# EAGLE design smartbedlight2 (EAGLE 6.1)
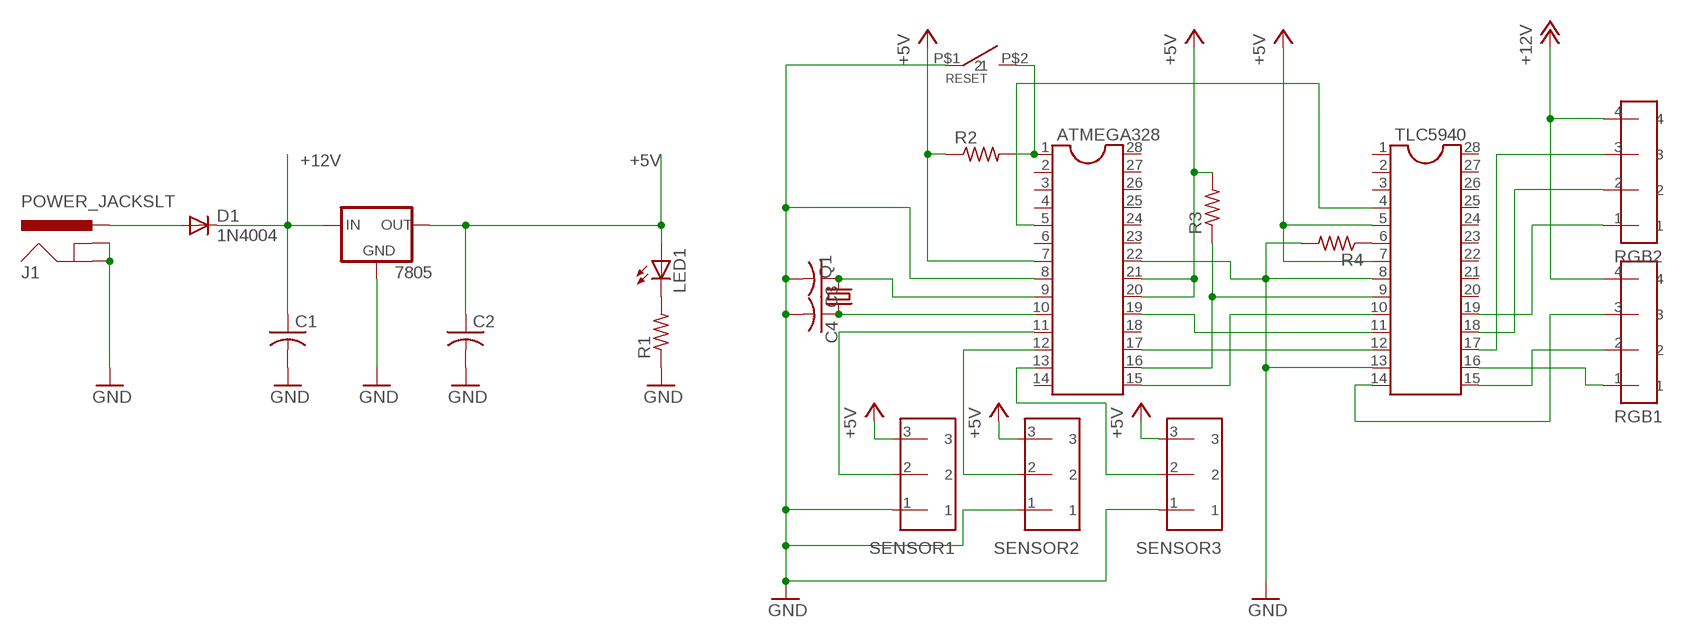
[diagram p0: schematic, sheet 1]

## Parts
7805  V_REG_78XXSIDE  [78XXL]
ATMEGA328  DIL28-3  [DIL28-3]
C1  C-US025-030X050  [C025-030X050]
C2  C-US025-030X050  [C025-030X050]
C3  C-US025-025X050  [C025-025X050]
C4  C-US025-025X050  [C025-025X050]
D1  1N4004  [DO41-10]
J1  POWER_JACKSLT  [POWER_JACK_SLOT]
LED1  LED5MM  [LED5MM]
Q1  CRYSTALHC49U-V  [HC49U-V]
R1  R-US_0204/7  [0204/7]
R2  R-US_0207/10  [0207/10]
R3  R-US_0207/10  [0207/10]
R4  R-US_0207/10  [0207/10]
RESET  TACK_SWITCH  [TACK_SWITCH]
RGB1  PINHEAD4  [PINHEAD4]
RGB2  PINHEAD4  [PINHEAD4]
SENSOR1  PINHEAD3  [PINHEAD]
SENSOR2  PINHEAD3  [PINHEAD]
SENSOR3  PINHEAD3  [PINHEAD]
TLC5940  DIL28-3  [DIL28-3]

## Nets
+5V: 7805.OUT ATMEGA328.7 ATMEGA328.20 ATMEGA328.21 C2.1 LED1.A R2.1 R3.2 SENSOR1.3 SENSOR2.3 SENSOR3.3 TLC5940.5 TLC5940.7
+12V: 7805.IN C1.1 D1.C RGB1.4 RGB2.4
GND: 7805.GND ATMEGA328.8 ATMEGA328.22 C1.2 C2.2 C3.2 C4.2 J1.GND@1(GNDBREAK) J1.GND@2(GND) R1.1 R4.2 RESET.P$1 SENSOR1.1 SENSOR2.1 SENSOR3.1 TLC5940.8 TLC5940.13
N$1: LED1.K(C) R1.2
N$2: D1.A J1.PWR
N$3: ATMEGA328.1 R2.2 RESET.P$2
N$4: ATMEGA328.9 C3.1 Q1.2
N$5: ATMEGA328.10 C4.1 Q1.1
N$6: ATMEGA328.19 TLC5940.11
N$7: ATMEGA328.17 TLC5940.12
N$8: ATMEGA328.16 R3.1 TLC5940.9
N$9: ATMEGA328.15 TLC5940.10
N$10: R4.1 TLC5940.6
N$11: RGB2.1 TLC5940.19
N$12: ATMEGA328.5 TLC5940.4
N$13: RGB1.3 TLC5940.14
N$14: RGB1.2 TLC5940.15
N$15: RGB1.1 TLC5940.16
N$16: RGB2.3 TLC5940.17
N$17: RGB2.2 TLC5940.18
N$18: ATMEGA328.11 SENSOR1.2
N$19: ATMEGA328.12 SENSOR2.2
N$20: ATMEGA328.13 SENSOR3.2
Unconnected: ATMEGA328.2 ATMEGA328.3 ATMEGA328.4 ATMEGA328.6 ATMEGA328.14 ATMEGA328.18 ATMEGA328.23 ATMEGA328.24 ATMEGA328.25 ATMEGA328.26 ATMEGA328.27 ATMEGA328.28 TLC5940.1 TLC5940.2 TLC5940.3 TLC5940.20 TLC5940.21 TLC5940.22 TLC5940.23 TLC5940.24 TLC5940.25 TLC5940.26 TLC5940.27 TLC5940.28

## Library data of the parts
7805 = SparkFun:V_REG_78XX: Voltage Regulator Standard 7805 5V regulator. IGO (Input Ground Output). Spark Fun Electronics SKU : COM-00107
ATMEGA328 TLC5940 = ic-package:DIL28: Dual In Line
C1 C2 = rcl:C-US: CAPACITOR, American symbol
C3 C4 = resistor:C-US: CAPACITOR, American symbol
D1 = diode:1N4004: DIODE general purpose rectifier, 1 A
J1 = SparkFun:POWER_JACK: Power Jack This is the standard 5.5mm barrel jack for power. The PTH is the most common, proven, reliable, footprint. All others are experimental. The Slot footprint only works if the mill layer is transmitted to the PCB fab house so be warned. Spark Fun Electronics SKU : PRT-00119. Mating wall wart : TOL-00298 (and others)
LED1 = led:LED: LED OSRAM: - CHIPLED LG R971, LG N971, LY N971, LG Q971, LY Q971, LO R971, LY R971 LH N974, LH R974 LS Q976, LO Q976, LY Q976 LO Q996 - Hyper CHIPLED LW Q18S LB Q993, LB Q99A, LB R99A - SideLED LS A670, LO A670, LY A670, LG A670, LP A670 LB A673, LV A673, LT A673, LW A673 LH A674 LY A675 LS A676, LA A676, LO A676, LY A676, LW A676 LS A679, LY A679, LG A679 - Hyper Micro SIDELED® LS Y876, LA Y876, LO Y876, LY Y876 LT Y87S - SmartLED LW L88C, LW L88S LB L89C, LB L89S, LG L890 LS L89K, LO L89K, LY L89K LS L896, LA L896, LO L896, LY L896 - TOPLED LS T670, LO T670, LY T670, LG T670, LP T670 LSG T670, LSP T670, LSY T670, LOP T670, LYG T670 LG T671, LOG T671, LSG T671 LB T673, LV T673, LT T673, LW T673 LH T674 LS T676, LA T676, LO T676, LY T676, LB T676, LH T676, LSB T676, LW T676 LB T67C, LV T67C, LT T67C, LS T67K, LO T67K, LY T67K, LW E67C LS E67B, LA E67B, LO E67B, LY E67B, LB E67C, LV E67C, LT E67C LW T67C LS T679, LY T679, LG T679 LS T770, LO T770, LY T770, LG T770, LP T770 LB T773, LV T773, LT T773, LW T773 LH T774 LS E675, LA E675, LY E675, LS T675 LS T776, LA T776, LO T776, LY T776, LB T776 LHGB T686 LT T68C, LB T68C - Hyper Mini TOPLED® LB M676 - Mini TOPLED Santana® LG M470 LS M47K, LO M47K, LY M47K Source: http://www.osram.convergy.de LUXEON: - LUMILED® LXK2-PW12-R00, LXK2-PW12-S00, LXK2-PW14-U00, LXK2-PW14-V00 LXK2-PM12-R00, LXK2-PM12-S00, LXK2-PM14-U00 LXK2-PE12-Q00, LXK2-PE12-R00, LXK2-PE12-S00, LXK2-PE14-T00, LXK2-PE14-U00 LXK2-PB12-K00, LXK2-PB12-L00, LXK2-PB12-M00, LXK2-PB14-N00, LXK2-PB14-P00, LXK2-PB14-Q00 LXK2-PR12-L00, LXK2-PR12-M00, LXK2-PR14-Q00, LXK2-PR14-R00 LXK2-PD12-Q00, LXK2-PD12-R00, LXK2-PD12-S00 LXK2-PH12-R00, LXK2-PH12-S00 LXK2-PL12-P00, LXK2-PL12-Q00, LXK2-PL12-R00 Source: www.luxeon.com KINGBRIGHT: KA-3528ASYC Source: www.kingbright.com
Q1 = crystal:CRYSTAL: CRYSTAL; OC_FARNELL: 1666969; OC_NEWARK: unknown
R1 = rcl:R-US_: RESISTOR, American symbol
R2-R4 = resistor:R-US_: RESISTOR, American symbol
RESET = compass:TACK_SWITCH
RGB1 RGB2 = pinhead3.96:PINHEAD4
SENSOR1-SENSOR3 = pinhead3.96:PINHEAD3

## Board
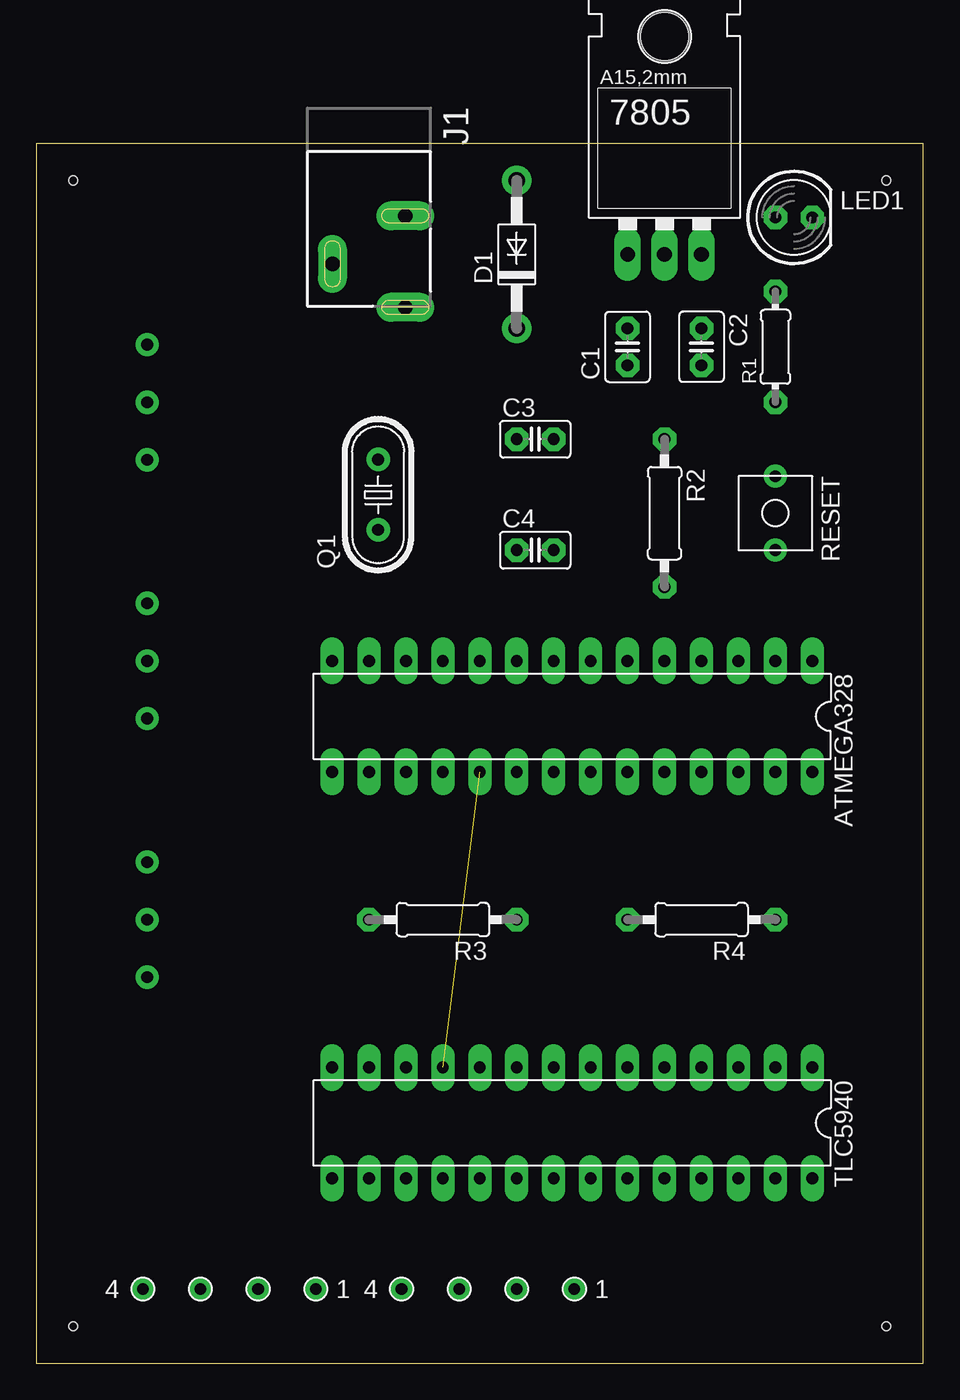
[diagram p1: board, top side]
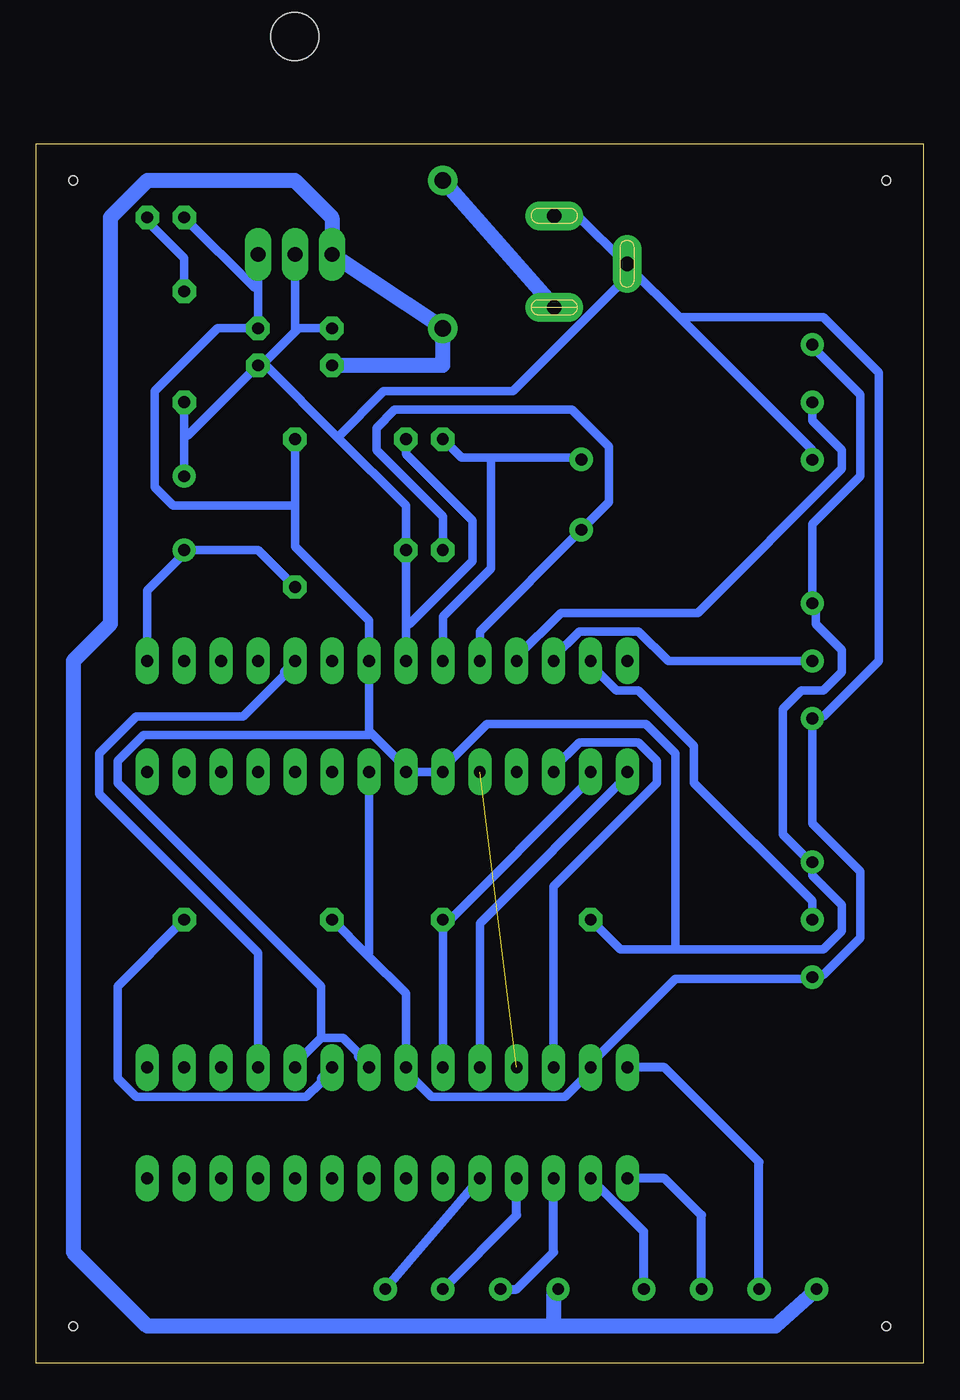
[diagram p2: board, bottom side, seen from below]

Size 60.96 x 83.82 mm. Coordinates in mm from the lower left corner, seen from the top.
Outline: 0,0 60.96,0 60.96,83.82 0,83.82 0,0
Copper layers (1*16): Top 0.035mm / dielectric 1.5mm / Bottom 0.035mm
Design rules: minimum track width 0.6mm, minimum drill 0.8mm, track to track 0.6mm, track to pad 0.7mm, pad to pad 0.3mm, via to via 0.8mm, smd to smd 8mil, copper to edge 10mil, drill to drill 8mil, minimum pad ring 0.4mm, minimum via ring 0.6mm, stop-mask expansion 0mil, vias tented up to drill 0mil, thermal gap 10mil
Holes 0.6 mm at 2.54,81.28 2.54,2.54 58.42,2.54 58.42,81.28

### Footprints (pad centres in the part's own frame; a part is rotated, then mirrored left to right if it is on the bottom)
78XXL = drill 1.016 long: GND 0,-3.81; IN -2.54,-3.81; OUT 2.54,-3.81 | hole 3.302: 0,11.176
DIL28-3 = drill 0.813 long: 1 -16.51,-3.81; 2 -13.97,-3.81; 3 -11.43,-3.81; 4 -8.89,-3.81; 5 -6.35,-3.81; 6 -3.81,-3.81; 7 -1.27,-3.81; 8 1.27,-3.81; 9 3.81,-3.81; 10 6.35,-3.81; 11 8.89,-3.81; 12 11.43,-3.81; 13 13.97,-3.81; 14 16.51,-3.81; 15 16.51,3.81; 16 13.97,3.81; 17 11.43,3.81; 18 8.89,3.81; 19 6.35,3.81; 20 3.81,3.81; 21 1.27,3.81; 22 -1.27,3.81; 23 -3.81,3.81; 24 -6.35,3.81; 25 -8.89,3.81; 26 -11.43,3.81; 27 -13.97,3.81; 28 -16.51,3.81
C025-030X050 = drill 0.813 octagon: 1 -1.27,0; 2 1.27,0
C025-025X050 = drill 0.813 octagon: 1 -1.27,0; 2 1.27,0
DO41-10 = drill 1.118: A 5.08,0; C -5.08,0
POWER_JACK_SLOT = drill 1 pad 2 long: GND@1 2.58,7.5; GND@2 7.58,10.8; PWR 2.58,13.8
LED5MM = drill 0.813 octagon: A -1.27,0; K 1.27,0
HC49U-V = drill 0.813: 1 -2.413,0; 2 2.413,0
0204/7 = drill 0.813 octagon: 1 -3.81,0; 2 3.81,0
0207/10 = drill 0.813 octagon: 1 -5.08,0; 2 5.08,0
TACK_SWITCH = drill 0.8: P$1 -2.54,0; P$2 2.54,0
PINHEAD4 = drill 0.8: 1 -3.96,0; 2 0,0; 3 3.96,0; 4 7.92,0
PINHEAD = drill 0.8: 1 -3.96,0; 2 0,0; 3 3.96,0

### Placement (x,y rotation side)
7805  43.18,80.01 0 top
ATMEGA328  36.83,44.45 180 top
C1  40.64,69.85 90 top
C2  45.72,69.85 270 top
C3  34.29,63.5 0 top
C4  34.29,55.88 0 top
D1  33.02,76.2 90 top
J1  27.94,86.36 180 top
LED1  52.07,78.74 0 top
Q1  23.5,59.69 90 top
R1  50.8,69.85 90 top
R2  43.18,58.42 270 top
R3  27.94,30.48 180 top
R4  45.72,30.48 180 top
RESET  50.8,58.42 270 top
RGB1  15.24,5.08 180 top
RGB2  33.02,5.08 180 top
SENSOR1  7.62,66.04 90 top
SENSOR2  7.62,48.26 90 top
SENSOR3  7.62,30.48 90 top
TLC5940  36.83,16.51 180 top

### Tracks (layer width: path | path; a pad name or v marks a point on that pad's centre or on a via)
+5V
  Bottom 0.6: SENSOR1.3 7.62,69.85 4.32,66.55 4.32,60.96 7.62,57.66 SENSOR2.3 7.37,52.07 7.37,50.8 5.59,49.02 5.59,47.5 6.86,46.23 8.38,46.23 9.65,44.96 9.65,36.32 7.87,34.54 SENSOR3.3 7.62,33.53 5.59,31.5 5.59,29.72 6.86,28.45 17.02,28.45 | 17.02,28.45 20.83,28.45 R3.2 | 7805.OUT 45.72,73.91 | 45.72,73.91 C2.1 48.51,71.12 52.83,66.8 52.83,60.2 51.56,58.93 43.18,58.93 | LED1.A 45.97,73.91 45.72,73.91 | TLC5940.7 38.86,21.08 38.86,21.34 39.88,22.35 41.4,22.35 | 41.4,22.35 43.18,20.57 TLC5940.5 | 38.1,43.43 ATMEGA328.7 38.1,51.05 43.18,56.13 43.18,58.93 | 38.1,43.43 35.56,40.89 ATMEGA328.21 ATMEGA328.20 33.02,40.89 29.97,43.94 19.05,43.94 17.02,41.91 17.02,28.45 | 43.18,58.93 R2.1 | 41.4,22.35 41.4,25.91 55.37,39.88 55.37,41.4 53.59,43.18 38.1,43.18 38.1,43.43
+12V
  Bottom 1.016: RGB1.4 10.16,2.54 25.4,2.54 | 25.4,2.54 53.34,2.54 58.42,7.62 58.42,48.26 55.88,50.8 55.88,78.74 53.34,81.28 43.18,81.28 40.64,78.74 7805.IN D1.C 33.02,68.58 C1.1 | RGB2.4 25.4,5.08 25.4,2.54
GND
  Bottom 0.6: R4.2 38.23,28.07 | 38.23,28.07 35.56,25.4 TLC5940.8 35.56,20.07 33.78,18.29 24.64,18.29 22.86,20.07 TLC5940.13 22.86,20.57 17.02,26.42 7.62,26.42 SENSOR3.1 7.37,26.67 6.86,26.67 4.32,29.21 4.32,33.78 7.62,37.08 SENSOR2.1 7.37,44.45 6.86,44.45 3.05,48.26 3.05,68.07 6.86,71.88 16.51,71.88 16.64,71.75 | ATMEGA328.22 38.1,28.19 38.23,28.07 | SENSOR1.1 7.62,62.74 16.64,71.75 | 16.64,71.75 20.32,75.44 J1.GND@2 | J1.GND@1 25.15,78.74 23.62,78.74 20.57,75.69 J1.GND@2 | 35.56,50.8 C4.2 35.56,58.93 40.26,63.63 | 35.56,50.8 ATMEGA328.8 | C3.2 35.56,62.48 30.99,57.91 30.99,55.12 35.31,50.8 35.56,50.8 | R1.1 50.8,63.75 | 50.8,63.75 RESET.P$1 | C2.2 50.55,63.75 50.8,63.75 | 42.93,71.12 C1.2 | 42.93,71.12 45.47,68.58 C2.2 | 7805.GND 43.18,71.12 42.93,71.12 | 40.26,63.63 45.21,68.58 C2.2 | 40.26,63.63 37.08,66.8 28.19,66.8 20.07,74.93 J1.GND@2
N$1
  Bottom 0.6: R1.2 50.8,75.95 53.34,78.49 LED1.K
N$2
  Bottom 1.016: J1.PWR D1.A
N$3
  Bottom 0.6: R2.2 45.72,55.88 RESET.P$2 50.8,55.63 53.34,53.09 ATMEGA328.1
N$4
  Bottom 0.6: 29.72,62.23 31.75,62.23 C3.1 | 29.72,62.23 23.62,62.23 Q1.2 | ATMEGA328.9 33.02,51.31 29.72,54.61 29.72,62.23
N$5
  Bottom 0.6: ATMEGA328.10 30.48,50.29 Q1.1 21.59,59.18 21.59,62.99 24.13,65.53 36.32,65.53 37.59,64.26 37.59,62.74 33.02,58.17 C4.1
N$6  (1 unrouted)
N$7
  Bottom 0.6: TLC5940.12 25.4,32.77 18.29,39.88 18.29,41.4 19.56,42.67 23.62,42.67 25.4,40.89 ATMEGA328.17
N$8
  Bottom 0.6: TLC5940.9 R3.1 32.77,30.23 22.86,40.13 ATMEGA328.16
N$9
  Bottom 0.6: TLC5940.10 30.48,30.23 20.32,40.39 ATMEGA328.15
N$10
  Bottom 0.6: TLC5940.6 41.4,19.56 41.4,19.3 42.42,18.29 54.1,18.29 55.37,19.56 55.37,25.91 R4.1
N$11
  Bottom 0.61: RGB2.1 TLC5940.19
N$12
  Bottom 0.6: ATMEGA328.5 43.94,47.5 43.94,47.24 46.74,44.45 54.1,44.45 56.64,41.91 56.64,39.12 45.72,28.19 TLC5940.4
N$13
  Bottom 0.61: RGB1.3 11.28,13.82 17.78,20.32 TLC5940.14
N$14
  Bottom 0.61: RGB1.2 15.24,10.16 17.78,12.7 TLC5940.15
N$15
  Bottom 0.61: RGB1.1 19.2,9.04 TLC5940.16
N$16
  Bottom 0.61: RGB2.3 27.94,5.08 25.4,7.62 TLC5940.17
N$17
  Bottom 0.61: RGB2.2 27.94,10.16 TLC5940.18
N$18
  Bottom 0.6: SENSOR1.2 7.62,64.77 5.59,62.74 5.59,61.47 15.49,51.56 24.89,51.56 27.94,48.51 ATMEGA328.11
N$19
  Bottom 0.6: SENSOR2.2 17.53,48.26 19.56,50.29 23.62,50.29 25.4,48.51 ATMEGA328.12
N$20
  Bottom 0.6: SENSOR3.2 7.62,31.75 15.75,39.88 15.75,42.42 19.56,46.23 21.08,46.23 22.86,48.01 ATMEGA328.13